# EAGLE design procesor+pot+display (EAGLE 6.1)
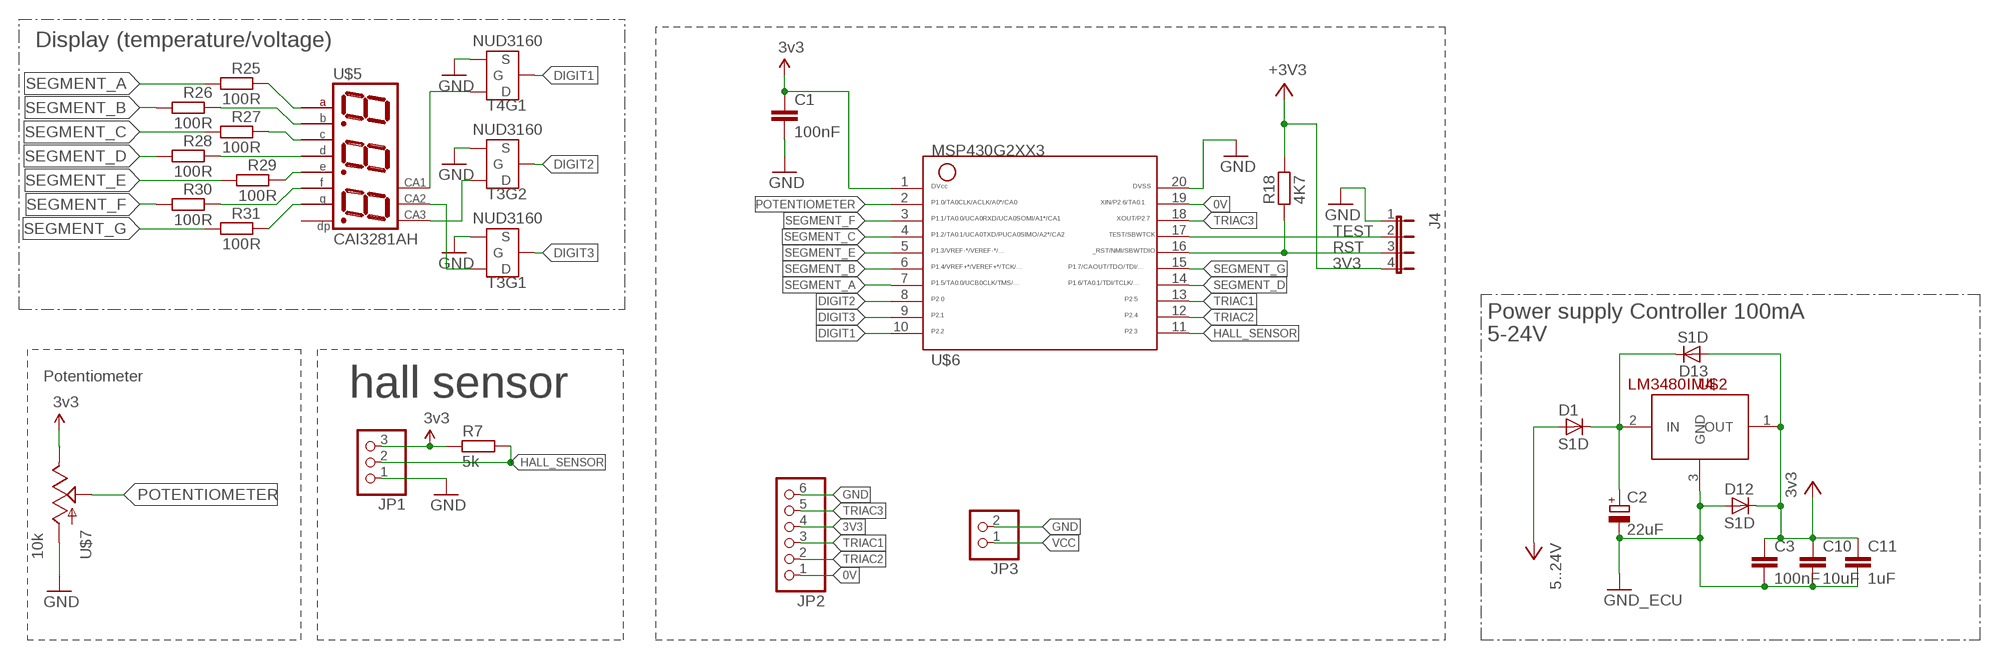
[diagram p0: schematic, sheet 1]

## Parts
C1  100nF  C0603  [0603]
C2  22uF  C_ELECTROLYTIC2  [C_EL_6.3X5.4]
C3  100nF  C1206  [1206]
C10  10uF  C1206  [1206]
C11  1uF  C1206  [1206]
D1  S1D  DIODES1D  [S1D]
D12  S1D  DIODES1D  [S1D]
D13  S1D  DIODES1D  [S1D]
J4  JP4  [JP4]
JP1  PINHD-1X3  [1X03]
JP2  PINHD-1X6/90  [1X06/90]
JP3  PINHD-1X2/90  [1X02/90]
R7  5k  R0603  [0603]
R18  4K7  R0805  [0805]
R25  100R  R-EU_R0603  [R0603]
R26  100R  R-EU_R0603  [R0603]
R27  100R  R-EU_R0603  [R0603]
R28  100R  R-EU_R0603  [R0603]
R29  100R  R-EU_R0603  [R0603]
R30  100R  R-EU_R0603  [R0603]
R31  100R  R-EU_R0603  [R0603]
T3  NUD3160  NUD3160-DUALSOT23-6  [SOT23-6]
T4  NUD3160  NUD3160-DUALSOT23-6  [SOT23-6]
U$2  LM3480IM4  [SOT23-3]
U$5  CAI3281AH  [7SEG_3DIGIT_10MMX30MM]
U$6  G2XX3---PW20  [PW20]
U$7  10k  POT  [POT]

## Nets
0V: JP2.1 U$6.19
3V3: C1.1 C3.1 C10.1 C11.1 D12.C D13.A J4.4 JP1.3 JP2.4 R7.1 R18.2 U$2.1(OUT) U$6.1 U$7.E@2(E) ; supply symbol labelled 3v3, +3V3
DIGIT1: T4.P$2(G) U$6.10
DIGIT2: T3.P$5(G) U$6.8
DIGIT3: T3.P$2(G) U$6.9
GND: C1.2 C2.- C3.2 C10.2 C11.2 D12.A J4.1 JP1.1 JP2.6 JP3.2 T3.P$1(S) T3.P$4(S) T4.P$1(S) U$2.3(GND) U$6.20 U$7.E@1(A) ; supply symbol labelled GND_ECU
HALL_SENSOR: JP1.2 R7.2 U$6.11
N$1: T3.P$6(D) U$5.P$8(CA)
N$3: C2.+ D1.C D13.C U$2.2(IN)
N$17: R31.1 U$5.P$3(G)
N$21: R30.1 U$5.P$5(F)
N$22: R29.1 U$5.P$9(E)
N$23: R28.1 U$5.P$2(D)
N$24: R27.1 U$5.P$4(C)
N$25: R26.1 U$5.P$6(B)
N$26: R25.1 U$5.P$10(A)
N$28: T3.P$3(D) U$5.P$7(CA)
N$29: T4.P$6(D) U$5.P$11(CA)
POTENTIOMETER: U$6.2 U$7.WAND(S)
RST: J4.3 R18.1 U$6.16
SEGMENT_A: R25.2 U$6.7
SEGMENT_B: R26.2 U$6.6
SEGMENT_C: R27.2 U$6.4
SEGMENT_D: R28.2 U$6.14
SEGMENT_E: R29.2 U$6.5
SEGMENT_F: R30.2 U$6.3
SEGMENT_G: R31.2 U$6.15
TEST: J4.2 U$6.17
TRIAC1: JP2.3 U$6.13
TRIAC2: JP2.2 U$6.12
TRIAC3: JP2.5 U$6.18
VCC: D1.A JP3.1 ; supply symbol labelled 5..24V
Unconnected: T4.P$3(D) T4.P$4(S) T4.P$5(G) U$5.P$1(DP)

## Notes on the sheet
- Display (temperature/voltage)
- Power supply Controller 100mA
- 5-24V
- Potentiometer
- hall sensor

## Library data of the parts
C1 C3 C10 C11 = adi_v1.6:C: SMD capacitor 0603 0805 1206
C2 = adi_v1.6:C_ELECTROLYTIC: Electrolytic capacitor 8x10mm 6.3x5.4mm
D1 D12 D13 = adi_v1.6:DIODE: Generic Diode
J4 = adi_v1.4:JP4
JP1 = pinhead:PINHD-1X3: PIN HEADER
JP2 = pinhead:PINHD-1X6: PIN HEADER
JP3 = pinhead:PINHD-1X2: PIN HEADER
R7 = adi_v1.6:R
R18 = adi_v1.2:R
R25-R31 = rcl:R-EU_: RESISTOR, European symbol
T3 T4 = adi_v1.3:NUD3160-DUAL
U$2 = SparkFun-PowerIC:LM3480IM4: Small package linear regulator
U$5 = adi_v1.4:CAI3281AH
U$6 = TI_MSP430_v16:G2XX3---PW20: MSP430G2XX1 TSSOP (PW) 20 Pin Package
U$7 = Serghei IR station:POT

## Board
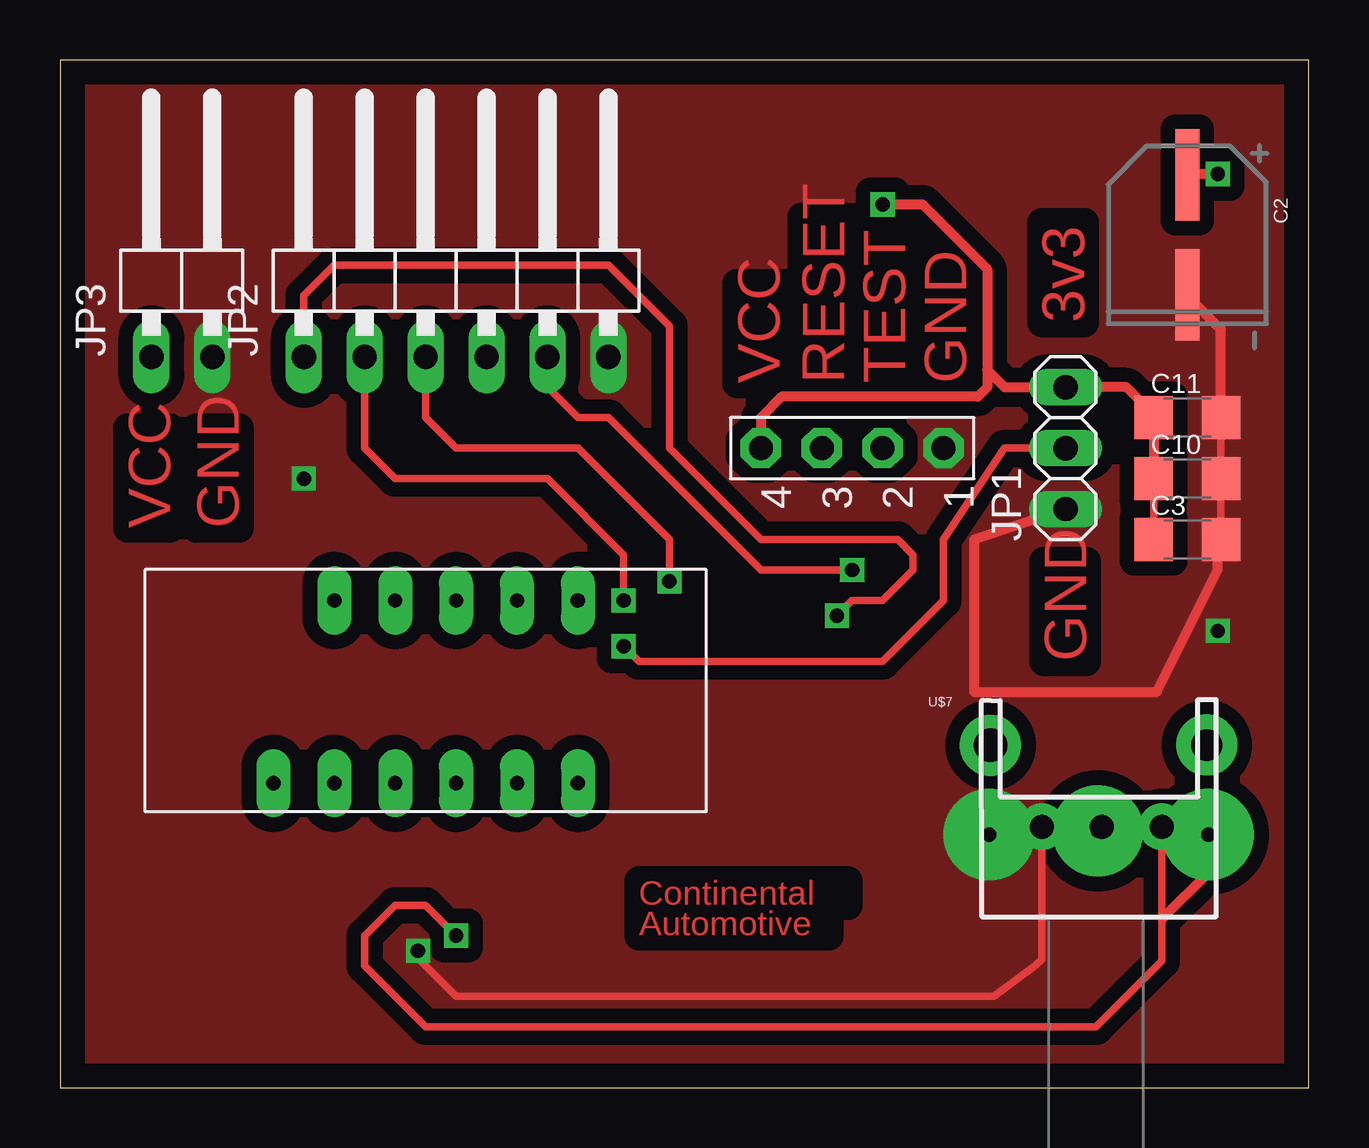
[diagram p1: board, top side]
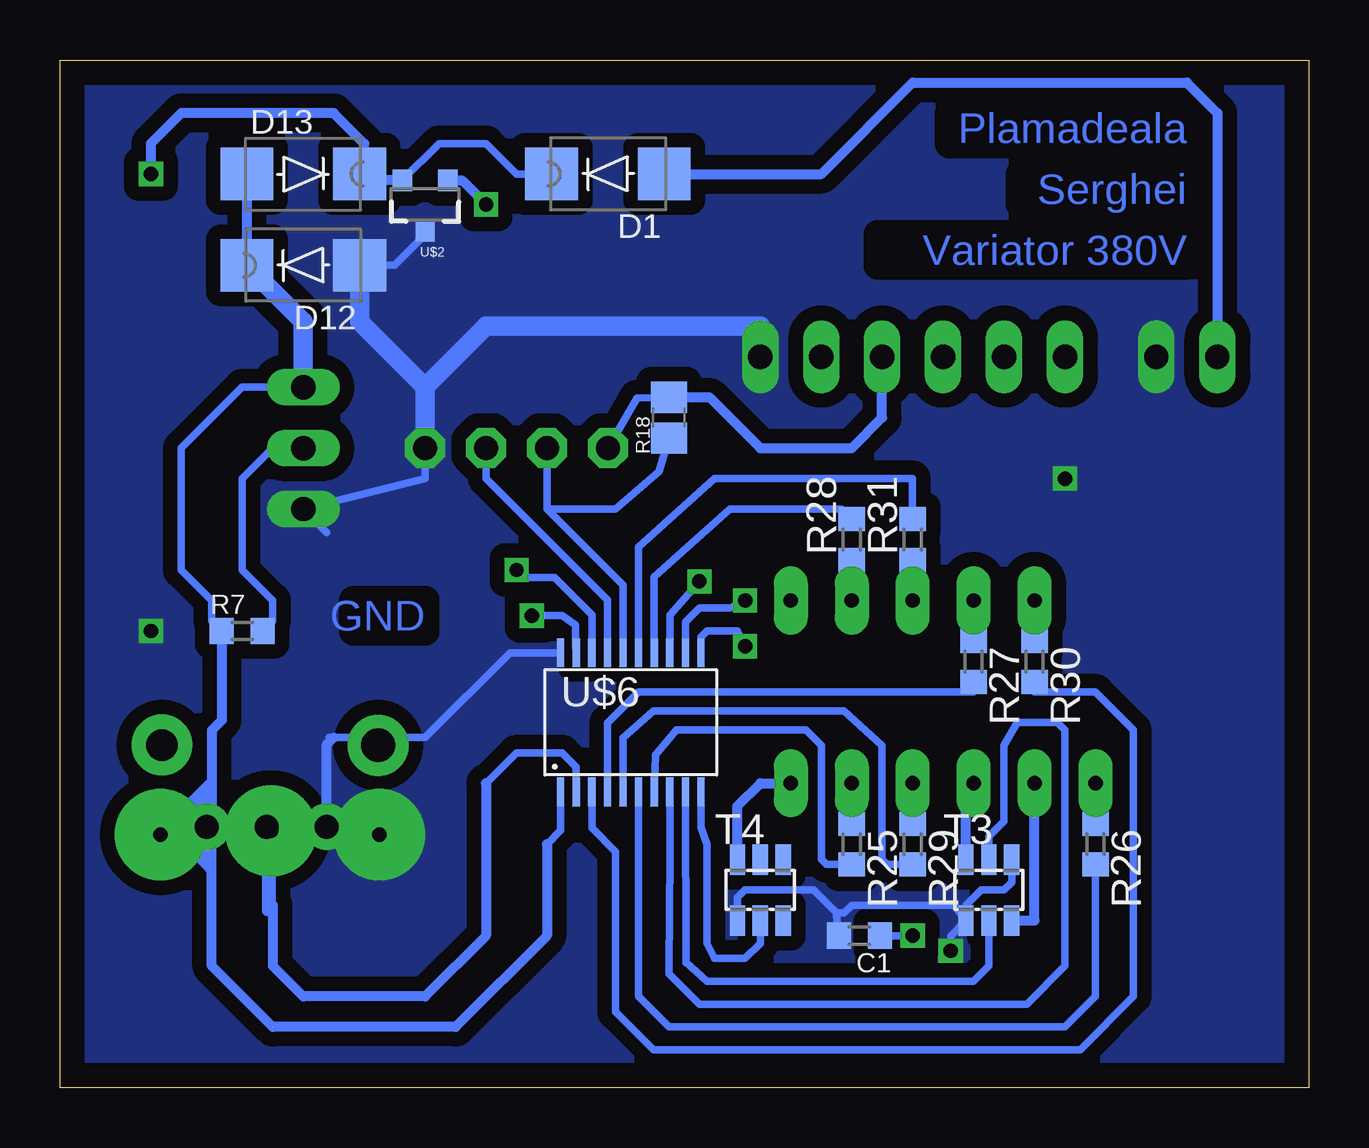
[diagram p2: board, bottom side, seen from below]

Size 52.05 x 42.85 mm. Coordinates in mm from the lower left corner, seen from the top.
Outline: 0,0 52.05,0 52.05,42.85 0,42.85 0,0
Copper layers (1*16): Top 0.035mm / dielectric 1.5mm / Bottom 0.035mm
Design rules: minimum track width 10mil, minimum drill 24mil, track to track 8mil, track to pad 8mil, pad to pad 8mil, via to via 8mil, smd to smd 8mil, copper to edge 40mil, drill to drill 8mil, minimum pad ring 10mil, minimum via ring 8mil, stop-mask expansion 4mil, vias tented up to drill 0mil, thermal gap 10mil

### Footprints (pad centres in the part's own frame; a part is rotated, then mirrored left to right if it is on the bottom)
0603 = smd 1 x 1.1: 1 -0.85,0; 2 0.85,0
C_EL_6.3X5.4 = smd 3.81 x 1: + -2.5,0; - 2.5,0
1206 = smd 1.6 x 1.8: 1 -1.4,0; 2 1.4,0
S1D = smd 2.2 x 2.2: A -2.35,0; C 2.35,0
JP4 = drill 1 pad 1.676 octagon: 1 0,-3.81; 2 0,-1.27; 3 0,1.27; 4 0,3.81
1X03 = drill 1.016 long: 1 -2.54,0; 2 0,0; 3 2.54,0
1X06/90 = drill 1.016 long: 1 -6.35,-3.81; 2 -3.81,-3.81; 3 -1.27,-3.81; 4 1.27,-3.81; 5 3.81,-3.81; 6 6.35,-3.81
1X02/90 = drill 1.016 long: 1 -1.27,-3.81; 2 1.27,-3.81
0805 = smd 1.3 x 1.5: 1 -0.85,0; 2 0.85,0
R0603 = smd 1 x 1.1: 1 -0.85,0; 2 0.85,0
SOT23-6 = smd 0.635 x 1.27: P$1 -0.953,-1.27; P$2 0,-1.27; P$3 0.953,-1.27; P$4 0.953,1.27; P$5 0,1.27; P$6 -0.953,1.27
SOT23-3 = smd 0.8 x 0.9: 1 -0.95,-1; 2 0.95,-1; 3 0,1.1
7SEG_3DIGIT_10MMX30MM = drill 0.6 pad 1.422 long: P$1 -6.35,-3.81; P$2 -3.81,-3.81; P$3 -1.27,-3.81; P$4 1.27,-3.81; P$5 3.81,-3.81; P$6 6.35,3.81; P$7 3.81,3.81; P$8 1.27,3.81; P$9 -1.27,3.81; P$10 -3.81,3.81; P$11 -6.35,3.81
PW20 = smd 0.3 x 1.2: 1 -2.925,-2.9; 2 -2.275,-2.9; 3 -1.625,-2.9; 4 -0.975,-2.9; 5 -0.325,-2.9; 6 0.325,-2.9; 7 0.975,-2.9; 8 1.625,-2.9; 9 2.275,-2.9; 10 2.925,-2.9; 11 2.925,2.9; 12 2.275,2.9; 13 1.625,2.9; 14 0.975,2.9; 15 0.325,2.9; 16 -0.325,2.9; 17 -0.975,2.9; 18 -1.625,2.9; 19 -2.275,2.9; 20 -2.925,2.9
POT = drill 1 pad 1.93: E@1 -2.25,15.97; E@2 2.75,15.97; WAND 0.25,15.97 | drill 1.3 pad 2.54: S1 4.62,19.37 | drill 1.4 pad 2.54: S2 -4.39,19.365

### Placement (x,y rotation side)
C1  18.73,6.35 180 bottom
C2  46.99,35.56 270 top
C3  46.99,22.86 0 top
C10  46.99,25.4 0 top
C11  46.99,27.94 0 top
D1  29.21,38.1 180 bottom
D12  41.91,34.29 180 bottom
D13  41.91,38.1 0 bottom
J4  33.02,26.67 90 top
JP1  41.91,26.67 90 top
JP2  16.51,34.29 0 top
JP3  5.08,34.29 0 top
R7  44.45,19.05 0 bottom
R18  26.67,27.94 90 bottom
R25  19.05,10.16 270 bottom
R26  8.89,10.16 270 bottom
R27  13.97,17.78 270 bottom
R28  19.05,22.86 90 bottom
R29  16.51,10.16 270 bottom
R30  11.43,17.78 270 bottom
R31  16.51,22.86 90 bottom
T3  13.34,8.26 0 bottom
T4  22.86,8.26 0 bottom
U$2  36.83,36.83 180 bottom
U$5  15.24,16.51 180 top
U$6  28.26,15.24 0 bottom
U$7  43.18,-5.08 0 top

### Tracks (layer width: path | path; a pad name or v marks a point on that pad's centre or on a via)
0V  (via drill 0.6)
  Top 0.305: v32.38,19.68 33.02,20.32 34.29,20.32 35.56,21.59 35.56,22.23 34.92,22.86 29.21,22.86 25.4,26.67 25.4,31.75 22.86,34.29 11.43,34.29 10.16,33.02 JP2.1
  Bottom 0.305: v32.38,19.68 31.11,19.68 30.56,19.29 30.56,18.43 U$6.19
3V3  (via drill 0.6, 0.6 pad 3.81)  (1 unrouted)
  Top 0.305: U$7.E@2 45.93,5.29 43.18,2.54 15.24,2.54 12.7,5.08 12.7,6.35 13.97,7.62 15.24,7.62 v16.51,6.35 | C3.1 C10.1
  Top 0.406: v34.29,36.83 35.96,36.83 38.66,34.13 38.66,29.92 | 38.66,29.92 39.37,29.21 JP1.3 44.45,29.21 45.59,28.07 C11.1 C10.1 | 38.66,29.92 38.66,29.21 38.26,28.81 30.08,28.81 29.21,27.94 J4.4 | v47.86,10.56 47.86,8.97 45.96,7.06
  Bottom 0.305: JP1.3 44.45,29.21 46.99,26.67 46.99,21.59 45.72,20.32 45.72,19.47 R7.1 | v16.51,6.35 C1.1 | U$6.1 31.18,10.73 31.75,10.16 | R18.2 28,28.76 J4.4
  Bottom 0.406: U$2.1 35.29,37.83 v34.29,36.83 | D13.A D12.C | 31.75,10.16 31.75,6.35 35.56,2.54 43.18,2.54 45.72,5.08 45.72,10.16 | R7.1 45.3,15.33 45.72,14.91 45.72,12.78 | 45.72,12.3 45.72,10.16 | 45.72,10.16 46.28,10.16 | 48.18,10.16 48.26,10.16 48.26,10.56 48.1,10.72 45.96,10.72 45.88,10.64 46.04,10.48 47.78,10.48 v47.86,10.56 47.94,10.56 48.26,10.87 48.26,11.03 48.18,11.11 46.04,11.11 45.96,11.03 47.86,11.03 48.18,11.35 46.04,11.35 45.96,11.43 47.86,11.43 48.1,11.67 46.2,11.67 45.96,11.91 46.43,11.91 48.18,10.16 | 48.18,10.16 46.28,10.16 | 46.28,10.16 45.88,9.76 48.1,9.76 48.26,9.92 46.59,9.92 45.8,9.13 45.8,9.6 48.1,11.91 46.59,11.91 45.72,12.78 | 45.72,12.78 45.72,12.3 | 45.72,12.3 45.88,12.14 | R18.2 24.98,28.79 22.86,26.67 19.05,26.67 17.78,27.94 JP2.4
  Bottom 0.813: JP1.3 41.91,31.94 D12.C
DIGIT1
  Bottom 0.305: T4.P$2 22.86,6.03 23.5,5.4 24.77,5.4 25.08,6.03 25.08,10.16 25.33,10.86 U$6.10
DIGIT2
  Bottom 0.305: T3.P$5 13.34,10.48 12.7,11.11 12.7,14.29 12.14,15.24 10.48,15.24 10.16,14.92 10.16,5.08 11.75,3.49 25.4,3.49 26.67,4.76 26.67,5 26.63,9.64 U$6.8
DIGIT3
  Bottom 0.305: T3.P$2 13.34,5.08 13.97,4.45 25.08,4.45 25.96,5.24 25.96,5.22 U$6.9
GND  (via drill 0.6, 0.6 pad 3.81)
  Top 0.305: v14.92,5.71 14.92,5.4 16.51,3.81 38.93,3.81 40.64,5.08 40.93,5.37 U$7.E@1 | C3.2 C10.2 C11.2
  Top 0.406: JP1.1 38.1,22.86 38.1,16.51 45.72,16.51 48.26,21.59 48.26,22.73 C3.2 | C11.2 48.39,31.62 46.99,33.02 C2.-
  Bottom 0.305: T4.P$1 23.81,7.94 23.5,8.26 20.64,8.26 19.68,7.3 | 19.68,7.3 19.68,7.2 C1.2 | T3.P$1 14.76,7.62 19.05,7.62 19.37,7.3 19.68,7.3 | T3.P$1 14.29,7.62 13.65,8.26 12.7,8.26 12.38,8.57 T3.P$4 | v14.92,5.71 14.92,6.35 T3.P$1 | U$6.20 33.3,18.14 36.83,14.61 40.64,14.61 40.84,14.61 | J4.1 36.83,25.4 JP1.1 40.93,23.15 | U$2.3 36.83,35.56 38.1,34.29 39.37,34.29
  Bottom 0.406: U$7.E@1 40.93,14.31 40.64,14.61
  Bottom 0.813: J4.1 36.83,29.21 | 36.83,29.21 34.29,31.75 22.86,31.75 JP2.6 | D12.A 39.56,31.94 36.83,29.21
  other vias: 38.73,10.56 10.16,25.4 48.26,19.05
  pour Bottom (isolate 0.61, no thermals): 0,43.18 0,0 52.07,0 52.07,43.18
  pour Top (isolate 0.61, no thermals): 0,43.18 0,0 52.07,0 52.07,43.18
HALL_SENSOR  (via drill 0.6)
  Top 0.305: JP1.2 39.37,26.67 36.83,22.86 36.83,20.32 34.29,17.78 24.13,17.78 v23.5,18.41
  Bottom 0.305: U$6.11 25.33,18.8 25.08,19.05 23.81,19.05 v23.5,18.41 | JP1.2 43.18,26.67 44.45,25.4 44.45,21.59 43.18,20.32 43.18,19.47 R7.2
N$1
  Bottom 0.406: T3.P$6 14.29,12.38 U$5.P$8
N$3  (via drill 0.6)
  Top 0.406: v48.26,38.1 47.03,38.1 C2.+
  Bottom 0.305: D1.C 33.02,38.1 34.29,39.37 36.24,39.37 U$2.2
  Bottom 0.406: U$2.2 39.29,37.83 D13.C 39.37,38.1 39.37,39.37 40.64,40.64 46.99,40.64 48.26,39.37 v48.26,38.1
N$17
  Bottom 0.406: U$5.P$3 R31.1
N$21
  Bottom 0.406: U$5.P$5 R30.1
N$22
  Bottom 0.406: U$5.P$9 R29.1
N$23
  Bottom 0.406: U$5.P$2 R28.1
N$24
  Bottom 0.406: U$5.P$4 R27.1
N$25
  Bottom 0.406: R26.1 U$5.P$6
N$26
  Bottom 0.406: U$5.P$10 R25.1
N$28
  Bottom 0.406: T3.P$3 11.43,6.99 U$5.P$7
N$29
  Bottom 0.406: T4.P$6 23.81,11.75 22.86,12.7 U$5.P$11
POTENTIOMETER  (via drill 0.6 pad 3.81)
  Bottom 0.305: U$6.2 30.53,13.39 31.11,13.97 33.02,13.97 34.29,12.7
  Bottom 0.406: 34.29,12.7 34.29,6.35 36.83,3.81 41.91,3.81 43.18,5.08 43.18,7.62 | U$7.WAND 43.43,7.37 43.18,7.62 | v43.26,10.72 43.26,7.7 43.18,7.62
RST
  Bottom 0.305: U$6.16 28.58,20.96 31.75,24.13 | 31.75,24.13 J4.3 | R18.1 27.09,25.69 28.89,24.13 31.75,24.13
SEGMENT_A
  Bottom 0.305: R25.2 20.11,9.31 20.32,9.53 20.32,14.29 20.95,14.92 26.35,14.92 27.23,13.89 27.23,13.79 U$6.7
SEGMENT_B
  Bottom 0.305: R26.2 8.89,3.81 10.16,2.54 26.67,2.54 27.94,3.81 27.94,8.89 27.93,8.9 U$6.6
SEGMENT_C
  Bottom 0.305: U$6.4 29.23,15.22 27.94,16.51 13.97,16.51 R27.2
SEGMENT_D
  Bottom 0.305: U$6.14 27.28,21.3 24.13,24.13 19.47,24.13 R28.2
SEGMENT_E
  Bottom 0.305: R29.2 17.57,9.31 17.78,9.53 17.78,14.29 19.37,15.72 27.3,15.72 28.58,14.6 U$6.5
SEGMENT_F
  Bottom 0.305: R30.2 11.43,16.51 8.89,16.51 7.3,14.92 7.3,3.81 9.53,1.59 27.3,1.59 28.89,3.17 28.89,9.84 29.88,10.83 U$6.3
SEGMENT_G
  Bottom 0.305: R31.2 16.51,25.4 24.77,25.4 27.94,22.54 U$6.15
TEST
  Bottom 0.305: U$6.17 29.23,20.34 34.29,25.4 J4.2
TRIAC1  (via drill 0.6)
  Top 0.305: v25.4,21.11 25.4,22.86 21.59,26.67 16.51,26.67 15.24,27.94 JP2.3
  Bottom 0.305: U$6.13 26.63,19.72 v25.4,21.11
TRIAC2  (via drill 0.6)
  Top 0.305: v23.5,20.32 23.5,22.23 20.32,25.4 13.97,25.4 12.7,26.67 JP2.2
  Bottom 0.305: U$6.12 25.98,19.42 25.4,20 24.13,20 v23.5,20.32
TRIAC3  (via drill 0.6)
  Top 0.305: v33.02,21.59 29.21,21.59 22.86,27.94 21.59,27.94 20.32,29.21 JP2.5
  Bottom 0.305: U$6.18 29.88,19.72 31.43,21.27 32.7,21.27 v33.02,21.59
VCC
  Bottom 0.406: D1.A 20.32,38.1 16.51,41.91 5.08,41.91 3.81,40.64 JP3.1

### Text on the board
Top: 3v3 | VCC | RESET | TEST | GND | VCC | GND | GND | Continental | Automotive
Bottom: Plamadeala | Serghei | Variator 380V | GND